# Altium schematic sheet TTP.SchDoc
size A4
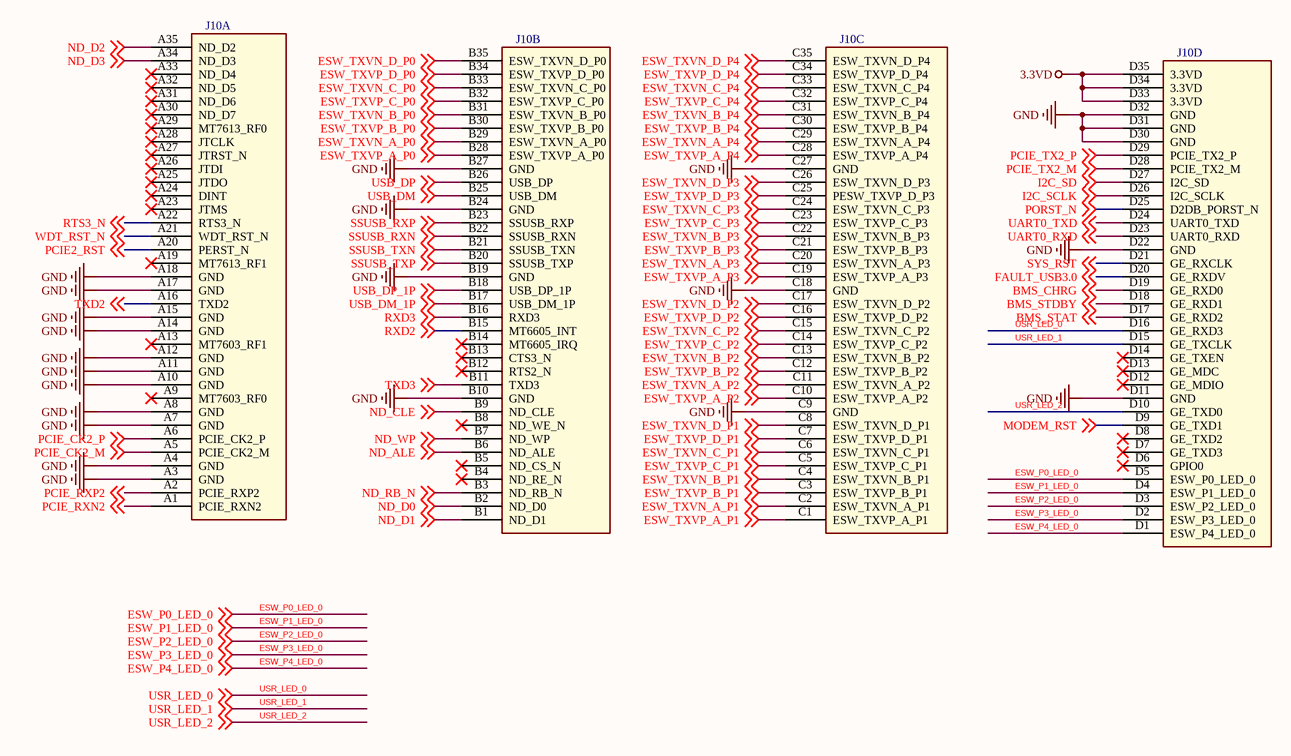
[diagram p0: TTP.SchDoc]

## Parts
J10  SoM  [SoM]  (value not drawn)  (parts A,B,C,D of 4)

## Nets
3.3VD: J10.D33(3.3VD) J10.D34(3.3VD) J10.D35(3.3VD)
GND: J10.A3(GND) J10.A4(GND) J10.A7(GND) J10.A8(GND) J10.A10(GND) J10.A11(GND) J10.A12(GND) J10.A14(GND) J10.A15(GND) J10.A17(GND) J10.A18(GND) J10.B10(GND) J10.B19(GND) J10.B24(GND) J10.B27(GND) J10.C9(GND) J10.C18(GND) J10.C27(GND) J10.D11(GND) J10.D22(GND) J10.D30(GND) J10.D31(GND) J10.D32(GND)
BMS_CHRG: J10.D19(GE_RXD0) ; off-sheet BMS_CHRG
BMS_STAT: J10.D17(GE_RXD2) ; off-sheet BMS_STAT
BMS_STDBY: J10.D18(GE_RXD1) ; off-sheet BMS_STDBY
ESW_P0_LED_0: J10.D5(ESW_P0_LED_0) ; off-sheet ESW_P0_LED_0
ESW_P1_LED_0: J10.D4(ESW_P1_LED_0) ; off-sheet ESW_P1_LED_0
ESW_P2_LED_0: J10.D3(ESW_P2_LED_0) ; off-sheet ESW_P2_LED_0
ESW_P3_LED_0: J10.D2(ESW_P3_LED_0) ; off-sheet ESW_P3_LED_0
ESW_P4_LED_0: J10.D1(ESW_P4_LED_0) ; off-sheet ESW_P4_LED_0
ESW_TXVN_A_P0: J10.B29(ESW_TXVN_A_P0) ; off-sheet ESW_TXVN_A_P0
ESW_TXVN_A_P1: J10.C2(ESW_TXVN_A_P1) ; off-sheet ESW_TXVN_A_P1
ESW_TXVN_A_P2: J10.C11(ESW_TXVN_A_P2) ; off-sheet ESW_TXVN_A_P2
ESW_TXVN_A_P3: J10.C20(ESW_TXVN_A_P3) ; off-sheet ESW_TXVN_A_P3
ESW_TXVN_A_P4: J10.C29(ESW_TXVN_A_P4) ; off-sheet ESW_TXVN_A_P4
ESW_TXVN_B_P0: J10.B31(ESW_TXVN_B_P0) ; off-sheet ESW_TXVN_B_P0
ESW_TXVN_B_P1: J10.C4(ESW_TXVN_B_P1) ; off-sheet ESW_TXVN_B_P1
ESW_TXVN_B_P2: J10.C13(ESW_TXVN_B_P2) ; off-sheet ESW_TXVN_B_P2
ESW_TXVN_B_P3: J10.C22(ESW_TXVN_B_P3) ; off-sheet ESW_TXVN_B_P3
ESW_TXVN_B_P4: J10.C31(ESW_TXVN_B_P4) ; off-sheet ESW_TXVN_B_P4
ESW_TXVN_C_P0: J10.B33(ESW_TXVN_C_P0) ; off-sheet ESW_TXVN_C_P0
ESW_TXVN_C_P1: J10.C6(ESW_TXVN_C_P1) ; off-sheet ESW_TXVN_C_P1
ESW_TXVN_C_P2: J10.C15(ESW_TXVN_C_P2) ; off-sheet ESW_TXVN_C_P2
ESW_TXVN_C_P3: J10.C24(ESW_TXVN_C_P3) ; off-sheet ESW_TXVN_C_P3
ESW_TXVN_C_P4: J10.C33(ESW_TXVN_C_P4) ; off-sheet ESW_TXVN_C_P4
ESW_TXVN_D_P0: J10.B35(ESW_TXVN_D_P0) ; off-sheet ESW_TXVN_D_P0
ESW_TXVN_D_P1: J10.C8(ESW_TXVN_D_P1) ; off-sheet ESW_TXVN_D_P1
ESW_TXVN_D_P2: J10.C17(ESW_TXVN_D_P2) ; off-sheet ESW_TXVN_D_P2
ESW_TXVN_D_P3: J10.C26(ESW_TXVN_D_P3) ; off-sheet ESW_TXVN_D_P3
ESW_TXVN_D_P4: J10.C35(ESW_TXVN_D_P4) ; off-sheet ESW_TXVN_D_P4
ESW_TXVP_A_P0: J10.B28(ESW_TXVP_A_P0) ; off-sheet ESW_TXVP_A_P0
ESW_TXVP_A_P1: J10.C1(ESW_TXVP_A_P1) ; off-sheet ESW_TXVP_A_P1
ESW_TXVP_A_P2: J10.C10(ESW_TXVP_A_P2) ; off-sheet ESW_TXVP_A_P2
ESW_TXVP_A_P3: J10.C19(ESW_TXVP_A_P3) ; off-sheet ESW_TXVP_A_P3
ESW_TXVP_A_P4: J10.C28(ESW_TXVP_A_P4) ; off-sheet ESW_TXVP_A_P4
ESW_TXVP_B_P0: J10.B30(ESW_TXVP_B_P0) ; off-sheet ESW_TXVP_B_P0
ESW_TXVP_B_P1: J10.C3(ESW_TXVP_B_P1) ; off-sheet ESW_TXVP_B_P1
ESW_TXVP_B_P2: J10.C12(ESW_TXVP_B_P2) ; off-sheet ESW_TXVP_B_P2
ESW_TXVP_B_P3: J10.C21(ESW_TXVP_B_P3) ; off-sheet ESW_TXVP_B_P3
ESW_TXVP_B_P4: J10.C30(ESW_TXVP_B_P4) ; off-sheet ESW_TXVP_B_P4
ESW_TXVP_C_P0: J10.B32(ESW_TXVP_C_P0) ; off-sheet ESW_TXVP_C_P0
ESW_TXVP_C_P1: J10.C5(ESW_TXVP_C_P1) ; off-sheet ESW_TXVP_C_P1
ESW_TXVP_C_P2: J10.C14(ESW_TXVP_C_P2) ; off-sheet ESW_TXVP_C_P2
ESW_TXVP_C_P3: J10.C23(ESW_TXVP_C_P3) ; off-sheet ESW_TXVP_C_P3
ESW_TXVP_C_P4: J10.C32(ESW_TXVP_C_P4) ; off-sheet ESW_TXVP_C_P4
ESW_TXVP_D_P0: J10.B34(ESW_TXVP_D_P0) ; off-sheet ESW_TXVP_D_P0
ESW_TXVP_D_P1: J10.C7(ESW_TXVP_D_P1) ; off-sheet ESW_TXVP_D_P1
ESW_TXVP_D_P2: J10.C16(ESW_TXVP_D_P2) ; off-sheet ESW_TXVP_D_P2
ESW_TXVP_D_P3: J10.C25(PESW_TXVP_D_P3) ; off-sheet ESW_TXVP_D_P3
ESW_TXVP_D_P4: J10.C34(ESW_TXVP_D_P4) ; off-sheet ESW_TXVP_D_P4
FAULT_USB3.0: J10.D20(GE_RXDV) ; off-sheet FAULT_USB3.0
I2C_SCLK: J10.D26(I2C_SCLK) ; off-sheet I2C_SCLK
I2C_SD: J10.D27(I2C_SD) ; off-sheet I2C_SD
MODEM_RST: J10.D9(GE_TXD1) ; off-sheet MODEM_RST
ND_ALE: J10.B6(ND_ALE) ; off-sheet ND_ALE
ND_CLE: J10.B9(ND_CLE) ; off-sheet ND_CLE
ND_D0: J10.B2(ND_D0) ; off-sheet ND_D0
ND_D1: J10.B1(ND_D1) ; off-sheet ND_D1
ND_D2: J10.A35(ND_D2) ; off-sheet ND_D2
ND_D3: J10.A34(ND_D3) ; off-sheet ND_D3
ND_RB_N: J10.B3(ND_RB_N) ; off-sheet ND_RB_N
ND_WP: J10.B7(ND_WP) ; off-sheet ND_WP
PCIE2_RST: J10.A20(PERST_N) ; off-sheet PCIE2_RST
PCIE_CK2_M: J10.A5(PCIE_CK2_M) ; off-sheet PCIE_CK2_M
PCIE_CK2_P: J10.A6(PCIE_CK2_P) ; off-sheet PCIE_CK2_P
PCIE_RXN2: J10.A1(PCIE_RXN2) ; off-sheet PCIE_RXN2
PCIE_RXP2: J10.A2(PCIE_RXP2) ; off-sheet PCIE_RXP2
PCIE_TX2_M: J10.D28(PCIE_TX2_M) ; off-sheet PCIE_TX2_M
PCIE_TX2_P: J10.D29(PCIE_TX2_P) ; off-sheet PCIE_TX2_P
PORST_N: J10.D25(D2DB_PORST_N) ; off-sheet PORST_N
RTS3_N: J10.A22(RTS3_N) ; off-sheet RTS3_N
RXD2: J10.B15(MT6605_INT) ; off-sheet RXD2
RXD3: J10.B16(RXD3) ; off-sheet RXD3
SSUSB_RXN: J10.B22(SSUSB_RXN) ; off-sheet SSUSB_RXN
SSUSB_RXP: J10.B23(SSUSB_RXP) ; off-sheet SSUSB_RXP
SSUSB_TXN: J10.B21(SSUSB_TXN) ; off-sheet SSUSB_TXN
SSUSB_TXP: J10.B20(SSUSB_TXP) ; off-sheet SSUSB_TXP
SYS_RST: J10.D21(GE_RXCLK) ; off-sheet SYS_RST
TXD2: J10.A16(TXD2) ; off-sheet TXD2
TXD3: J10.B11(TXD3) ; off-sheet TXD3
UART0_RXD: J10.D23(UART0_RXD) ; off-sheet UART0_RXD
UART0_TXD: J10.D24(UART0_TXD) ; off-sheet UART0_TXD
USB_DM: J10.B25(USB_DM) ; off-sheet USB_DM
USB_DM_1P: J10.B17(USB_DM_1P) ; off-sheet USB_DM_1P
USB_DP: J10.B26(USB_DP) ; off-sheet USB_DP
USB_DP_1P: J10.B18(USB_DP_1P) ; off-sheet USB_DP_1P
USR_LED_0: J10.D16(GE_RXD3) ; off-sheet USR_LED_0
USR_LED_1: J10.D15(GE_TXCLK) ; off-sheet USR_LED_1
USR_LED_2: J10.D10(GE_TXD0) ; off-sheet USR_LED_2
WDT_RST_N: J10.A21(WDT_RST_N) ; off-sheet WDT_RST_N

Not connected (* = marked no-connect by the designer): J10 A9(MT7603_RF0)* A13(MT7603_RF1)* A19(MT7613_RF1)* A23(JTMS)* A24(DINT)* A25(JTDO)* A26(JTDI)* A27(JTRST_N)* A28(JTCLK)* A29(MT7613_RF0)* A30(ND_D7)* A31(ND_D6)* A32(ND_D5)* A33(ND_D4)* B4(ND_RE_N)* B5(ND_CS_N)* B8(ND_WE_N)* B12(RTS2_N)* B13(CTS3_N)* B14(MT6605_IRQ)* D6(GPIO0)* D7(GE_TXD3)* D8(GE_TXD2)* D12(GE_MDIO)* D13(GE_MDC)* D14(GE_TXEN)*

## Library data of the parts
J10 = SoM: System: connector